# Altium schematic sheet LeftSide.SchDoc
size A4; SheetNumber: 3; SheetTotal: 3
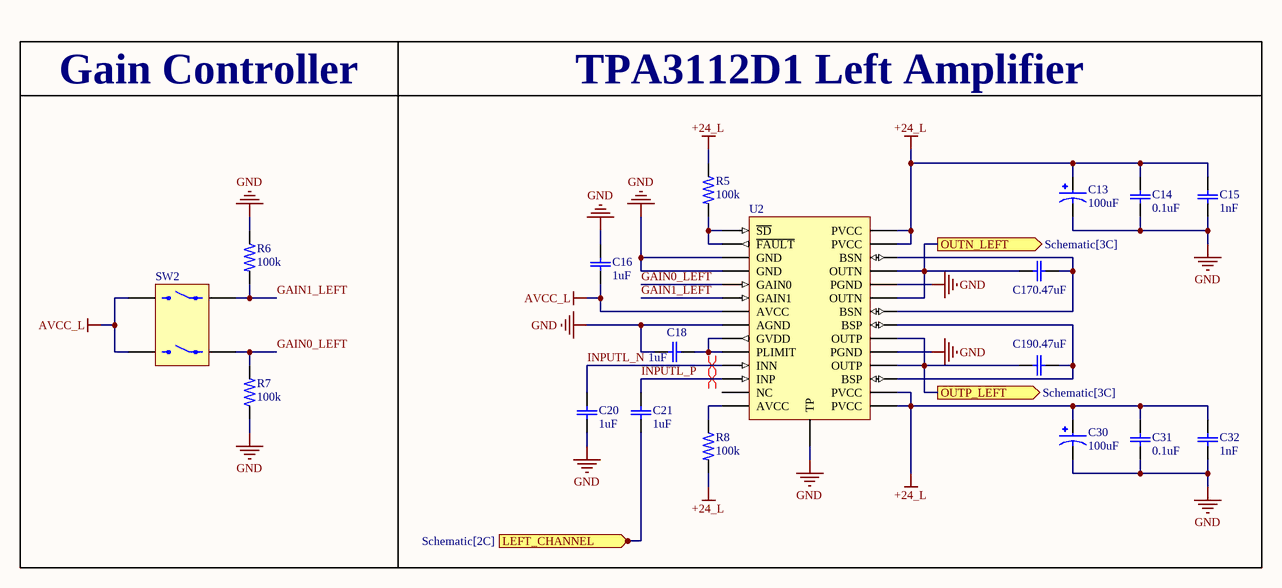
[diagram p0: LeftSide.SchDoc]

## Parts
C13  100uF  [CAPRADIAL_16X10]
C14  0.1uF  [CERAMIC0805]
C15  1nF  [CERAMIC0603]
C16  1uF  [CERAMIC0603]
C17  0.47uF  [CERAMIC0603]
C18  1uF  [CERAMIC0603]
C19  0.47uF  [CERAMIC0603]
C20  1uF  [CERAMIC0603]
C21  1uF  [CERAMIC0603]
C30  100uF  [CAPRADIAL_16X10]
C31  0.1uF  [CERAMIC0805]
C32  1nF  [CERAMIC0603]
R5  100k  [RES0603]
R6  100k  [RES0603]
R7  100k  [RES0603]
R8  100k  [RES0603]
SW2  DIP SWITCH - 2 POS  [KF1001 - 2 POS]  (value not drawn)
U2  TPA3112D1  [HTSSOP-28]  (value not drawn)

## Ports
LEFT_CHANNEL (in, see Schematic[2C]), OUTN_LEFT (out, see Schematic[3C]), OUTP_LEFT (out, see Schematic[3C])

## Nets
+24_L: C13.P C14.2(C2) C15.2(C2) C30.P C31.2(C2) C32.2(C2) R5.1 R8.2 U2.15(PVCC) U2.16(PVCC) U2.27(PVCC) U2.28(PVCC)
AVCC_L: C16.2(C2) SW2.2 SW2.3 U2.7(AVCC)
GND: C13.N C14.1(C1) C15.1(C1) C16.1(C1) C18.2(C2) C20.1(C1) C30.N C31.1(C1) C32.1(C1) R6.1 R7.1 U2.3(GND) U2.4(GND) U2.8(AGND) U2.19(PGND) U2.24(PGND) U2.29(TP)
GAIN0_LEFT: R7.2 SW2.1 U2.5(GAIN0)
GAIN1_LEFT: R6.2 SW2.4 U2.6(GAIN1)
INPUTL_N: C20.2(C2) U2.11(INN)
INPUTL_P: C21.2(C2) U2.12(INP)
LEFT_CHANNEL: C21.1(C1) ; port LEFT_CHANNEL
OUTN_LEFT: C17.2(C2) U2.23(OUTN) U2.25(OUTN) ; port OUTN_LEFT
OUTP_LEFT: C19.2(C2) U2.18(OUTP) U2.20(OUTP) ; port OUTP_LEFT
NetC17_1: C17.1(C1) U2.22(BSN) U2.26(BSN)
NetC18_1: C18.1(C1) U2.9(GVDD) U2.10(PLIMIT)
NetC19_1: C19.1(C1) U2.17(BSP) U2.21(BSP)
NetR5_2: R5.2 U2.1(~{SD}) U2.2(~{FAULT})
NetR8_1: R8.1 U2.14(AVCC)

Not connected (* = marked no-connect by the designer): U2 13(NC)

## Layout directives
differential pair: INPUTL_N, INPUTL_P

## Notes on the sheet
- Gain Controller
- TPA3112D1 Left Amplifier

## Library data of the parts
C13 C30 = CAP ELETRO/TANT: MP: EEU-EE2W560; MF: Panasonic; Digi-Key_Part_Number: P13679-ND; Check_prices: https://www.snapeda.com/parts/EEU-EE2W560/Panasonic/view-part/2337485/?ref=eda; Value: *; SnapEDA_Link: https://www.snapeda.com/parts/EEU-EE2W560/Panasonic/view-part/2337485/?ref=snap; Purchase-URL: https://pricing.snapeda.com/search/part/EEU-EE2W560/?ref=eda; Package: RADIAL-2 Panasonic
C14-C21 C31 C32 = Cap: MF: KEMET; MP: TAJC226M025RNJ; SnapEDA_Link: https://www.snapeda.com/parts/TAJC226M025RNJ/KEMET/view-part/?ref=snap; Availability: In Stock; Price: None; Purchase-URL: https://pricing.snapeda.com/search/part/TAJC226M025RNJ/?ref=eda; Package: None; Check_prices: https://www.snapeda.com/parts/TAJC226M025RNJ/KEMET/view-part/?ref=eda; Value: *
R5-R8 = RESISTOR SMD: MP: 3-1879460-6; Package: None; Price: None; Value: *; Availability: Unavailable
U2 = TPA3112D1: 25W Filter-Free Mono Class-D Audio Power Amplifier